# EAGLE design 4in4out (EAGLE 5.00)
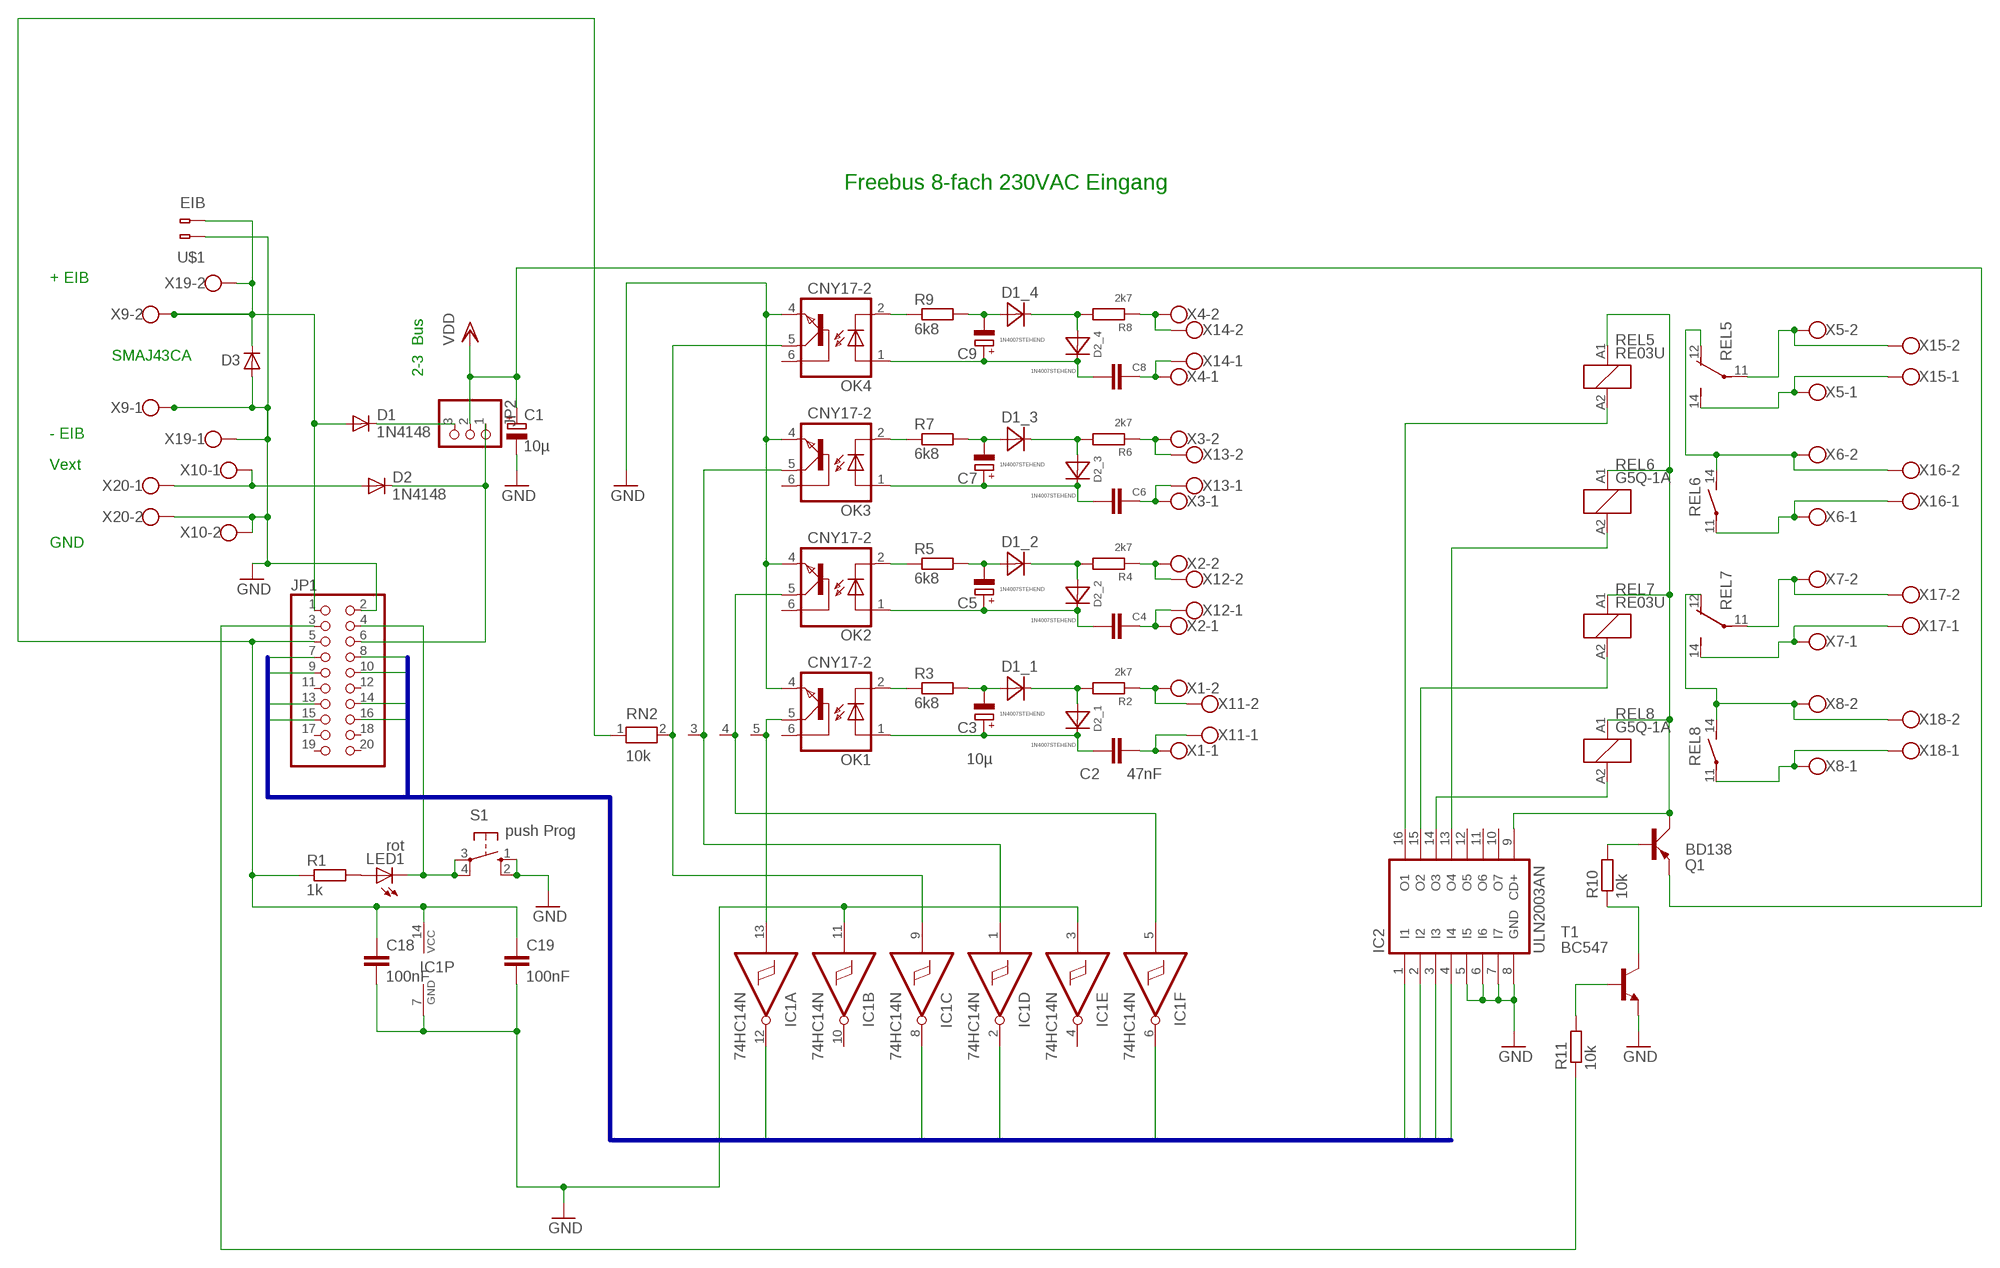
[diagram p0: schematic, sheet 1]

## Parts
C1  10µ  CPOL-EUE3.5-8  [E3,5-8]
C2  47nF  C-EU075-063X106  [C075-063X106]
C3  10µ  CPOL-EUE2-4  [E2-4]
C4  47nF  C-EU075-063X106  [C075-063X106]
C5  CPOL-EUE2-4  [E2-4]
C6  47nF  C-EU075-063X106  [C075-063X106]
C7  CPOL-EUE2-4  [E2-4]
C8  47nF  C-EU075-063X106  [C075-063X106]
C9  CPOL-EUE2-4  [E2-4]
C18  100nF  C-EU050-024X044  [C050-024X044]
C19  100nF  C-EU050-024X044  [C050-024X044]
D1  1N4148  [DO35-10]
D1_1  1N4007STEHEND  [RAD2,5]
D1_2  1N4007STEHEND  [RAD2,5]
D1_3  1N4007STEHEND  [RAD2,5]
D1_4  1N4007STEHEND  [RAD2,5]
D2  1N4148  [DO35-10]
D2_1  1N4007STEHEND  [RAD2,5]
D2_2  1N4007STEHEND  [RAD2,5]
D2_3  1N4007STEHEND  [RAD2,5]
D2_4  1N4007STEHEND  [RAD2,5]
D3  D-SMB  [SMB]
IC1  74HC14N  [DIL14]
IC2  ULN2003AN  [DIL16]
JP1  PINHD-2X10  [2X10]
JP2  PINHD-1X3  [1X03]
LED1  rot  LED3MM  [LED3MM]
OK1  CNY17-2  CNY17  [DIL06]
OK2  CNY17-2  CNY17  [DIL06]
OK3  CNY17-2  CNY17  [DIL06]
OK4  CNY17-2  CNY17  [DIL06]
Q1  BD138  BD140  [TO126AV]
R1  1k  R-EU_0204/7  [0204/7]
R2  2k7  R-EU_0207/2V  [0207/2V]
R3  6k8  R-EU_0207/2V  [0207/2V]
R4  2k7  R-EU_0207/2V  [0207/2V]
R5  6k8  R-EU_0207/2V  [0207/2V]
R6  2k7  R-EU_0207/2V  [0207/2V]
R7  6k8  R-EU_0207/2V  [0207/2V]
R8  2k7  R-EU_0207/2V  [0207/2V]
R9  6k8  R-EU_0207/2V  [0207/2V]
R10  10k  R-EU_0207/10  [0207/10]
R11  10k  R-EU_0207/10  [0207/10]
REL5  RE03U  [G5Q_1_EU]
REL6  G5Q-1A  RE030024  [RE-SCHRACK]
REL7  RE03U  [G5Q_1_EU]
REL8  G5Q-1A  RE030024  [RE-SCHRACK]
RN2  10k  RN04  [RN-5]
S1  push Prog  10-XX  [B3F-10XX]
T1  BC547  [TO92]
U$1  EIB  [BUSKLEMME243-724]
X1  W237-102W2POL5_08  [W237-132]
X2  W237-102W2POL5_08  [W237-132]
X3  W237-102W2POL5_08  [W237-132]
X4  W237-102W2POL5_08  [W237-132]
X5  W237-102W2POL5_08  [W237-132]
X6  W237-102W2POL5_08  [W237-132]
X7  W237-102W2POL5_08  [W237-132]
X8  W237-102W2POL5_08  [W237-132]
X9  W237-102W2POL5_08  [W237-132]
X10  W237-102W2POL5_08  [W237-132]
X11  W237-102AKL007-2P  [AKL007-02]
X12  W237-102AKL007-2P  [AKL007-02]
X13  W237-102AKL007-2P  [AKL007-02]
X14  W237-102AKL007-2P  [AKL007-02]
X15  W237-102AKL007-2P  [AKL007-02]
X16  W237-102AKL007-2P  [AKL007-02]
X17  W237-102AKL007-2P  [AKL007-02]
X18  W237-102AKL007-2P  [AKL007-02]
X19  W237-102AKL007-2P  [AKL007-02]
X20  W237-102AKL007-2P  [AKL007-02]

## Nets
230+_1: C2.1 C3.+ D2_1.C OK1.1(A)
230+_2: C4.1 C5.+ D2_2.C OK2.1(A)
230+_3: C6.1 C7.+ D2_3.C OK3.1(A)
230+_4: C8.1 C9.+ D2_4.C OK4.1(A)
230-_1: C3.- D1_1.A R3.2
230-_2: C5.- D1_2.A R5.2
230-_3: C7.- D1_3.A R7.2
230-_4: C9.- D1_4.A R9.2
230N_1: D1_1.C D2_1.A R2.2
230N_2: D1_2.C D2_2.A R4.2
230N_3: D1_3.C D2_3.A R6.2
230N_4: D1_4.C D2_4.A R8.2
GND: C1.- C18.2 C19.2 D3.2(A) IC1.3(E:I) IC1.7(P:GND) IC1.11(B:I) IC2.5(I5) IC2.6(I6) IC2.7(I7) IC2.8(GND) JP1.2 OK1.4(EMI) OK2.4(EMI) OK3.4(EMI) OK4.4(EMI) S1.1(S) S1.2(S1) T1.1(E) U$1.1(B-1) X9.1 X10.2 X19.1 X20.2
IO1: IC1.12(A:O) JP1.7
IO2: IC1.6(F:O) JP1.8
IO3: IC1.2(D:O) JP1.9
IO4: IC1.8(C:O) JP1.10
IO5: IC2.1(I1) JP1.13
IO6: IC2.4(I4) JP1.14
IO7: IC2.2(I2) JP1.15
IO8: IC2.3(I3) JP1.16
N$1: C8.2 X4.1 X14.1
N$2: R8.1 X4.2 X14.2
N$3: C6.2 X3.1 X13.1
N$4: R6.1 X3.2 X13.2
N$5: C4.2 X2.1 X12.1
N$6: R4.1 X2.2 X12.2
N$7: C2.2 X1.1 X11.1
N$8: R2.1 X1.2 X11.2
N$9: REL5.12(14:O) REL6.14(2:S) X6.2 X16.2
N$10: REL6.11(2:P) X6.1 X16.1
N$11: REL7.11(14:P) X7.2 X17.2
N$12: REL8.11(2:P) X8.1 X18.1
N$13: REL5.11(14:P) X5.2 X15.2
N$14: REL5.14(14:S) X5.1 X15.1
N$15: REL7.14(14:S) X7.1 X17.1
N$16: REL7.12(14:O) REL8.14(2:S) X8.2 X18.2
N$17: IC2.16(O1) REL5.A2
N$18: IC2.13(O4) REL6.A2
N$19: D2.A X10.1 X20.1
N$20: D1.A D3.1(C) JP1.1 U$1.2(B-2) X9.2 X19.2
N$21: IC2.15(O2) REL7.A2
N$22: IC2.14(O3) REL8.A2
N$23: IC1.13(A:I) OK1.5(COL) RN2.5
N$24: IC2.9(CD+) Q1.C REL5.A1 REL6.A1 REL7.A1 REL8.A1
N$25: IC1.5(F:I) OK2.5(COL) RN2.4
N$26: JP1.3 R11.1
N$27: JP1.4 LED1.K(C) S1.3(P) S1.4(P1)
N$28: LED1.A R1.2
N$29: IC1.1(D:I) OK3.5(COL) RN2.3
N$30: IC1.9(C:I) OK4.5(COL) RN2.2
N$32: D1.C JP2.3
N$33: R10.1 T1.3(C)
N$34: R11.2 T1.2(B)
N$35: D2.C JP1.6 JP2.1
N$37: Q1.B R10.2
OPT_1: OK1.2(C) R3.1
OPT_2: OK2.2(C) R5.1
OPT_3: OK3.2(C) R7.1
OPT_4: OK4.2(C) R9.1
VCC: C18.1 C19.1 IC1.14(P:VCC) JP1.5 R1.1 RN2.1
VDD: C1.+ JP2.2 Q1.E
Unconnected: IC1.4(E:O) IC1.10(B:O) IC2.10(O7) IC2.11(O6) IC2.12(O5) JP1.11 JP1.12 JP1.17 JP1.18 JP1.19 JP1.20 OK1.6(BAS) OK2.6(BAS) OK3.6(BAS) OK4.6(BAS)

## Buses
IO[1..8]

## Notes on the sheet
- Freebus 8-fach 230VAC Eingang
- + EIB
- SMAJ43CA
- 2-3  Bus
- - EIB
- Vext
- GND

## Library data of the parts
C1 C3 C5 C7 C9 = rcl:CPOL-EU: POLARIZED CAPACITOR, European symbol
C2 C4 C6 C8 C18 C19 = rcl:C-EU: CAPACITOR, European symbol
D1 D2 = diode:1N4148: DIODE high speed (Philips)
D1_1-D1_4 D2_1-D2_4 = diode:1N4007
D3 = semicon-smd-ipc:D-: DIODE unfilled
IC1 = 74xx-eu:74*14: Hex schmitt trigger INVERTER
IC2 = uln-udn:ULN2003A: DRIVER ARRAY
JP1 = pinhead:PINHD-2X10: PIN HEADER
JP2 = pinhead:PINHD-1X3: PIN HEADER
LED1 = led:LED: LED OSRAM: - CHIPLED LG R971, LG N971, LY N971, LG Q971, LY Q971, LO R971, LY R971 LH N974, LH R974 LS Q976, LO Q976, LY Q976 LO Q996 - Hyper CHIPLED LW Q18S LB Q993, LB Q99A, LB R99A - SideLED LS A670, LO A670, LY A670, LG A670, LP A670 LB A673, LV A673, LT A673, LW A673 LH A674 LY A675 LS A676, LA A676, LO A676, LY A676, LW A676 LS A679, LY A679, LG A679 - Hyper Micro SIDELED® LS Y876, LA Y876, LO Y876, LY Y876 LT Y87S - SmartLED LW L88C, LW L88S LB L89C, LB L89S, LG L890 LS L89K, LO L89K, LY L89K LS L896, LA L896, LO L896, LY L896 - TOPLED LS T670, LO T670, LY T670, LG T670, LP T670 LSG T670, LSP T670, LSY T670, LOP T670, LYG T670 LG T671, LOG T671, LSG T671 LB T673, LV T673, LT T673, LW T673 LH T674 LS T676, LA T676, LO T676, LY T676, LB T676, LH T676, LSB T676, LW T676 LB T67C, LV T67C, LT T67C, LS T67K, LO T67K, LY T67K, LW E67C LS E67B, LA E67B, LO E67B, LY E67B, LB E67C, LV E67C, LT E67C LW T67C LS T679, LY T679, LG T679 LS T770, LO T770, LY T770, LG T770, LP T770 LB T773, LV T773, LT T773, LW T773 LH T774 LS E675, LA E675, LY E675, LS T675 LS T776, LA T776, LO T776, LY T776, LB T776 LHGB T686 LT T68C, LB T68C - Hyper Mini TOPLED® LB M676 - Mini TOPLED Santana® LG M470 LS M47K, LO M47K, LY M47K Source: http://www.osram.convergy.de - LUMILED® LXK2-PW12-R00, LXK2-PW12-S00, LXK2-PW14-U00, LXK2-PW14-V00 LXK2-PM12-R00, LXK2-PM12-S00, LXK2-PM14-U00 LXK2-PE12-Q00, LXK2-PE12-R00, LXK2-PE12-S00, LXK2-PE14-T00, LXK2-PE14-U00 LXK2-PB12-K00, LXK2-PB12-L00, LXK2-PB12-M00, LXK2-PB14-N00, LXK2-PB14-P00, LXK2-PB14-Q00 LXK2-PR12-L00, LXK2-PR12-M00, LXK2-PR14-Q00, LXK2-PR14-R00 LXK2-PD12-Q00, LXK2-PD12-R00, LXK2-PD12-S00 LXK2-PH12-R00, LXK2-PH12-S00 LXK2-PL12-P00, LXK2-PL12-Q00, LXK2-PL12-R00 Source: www.luxeon.com
OK1-OK4 = optocoupler:CNY17: SIEMENS OPTO COUPLER
Q1 = transistor-power:BD140: PNP TRANSISTOR
R1-R11 = rcl:R-EU_: RESISTOR, European symbol
REL5 REL7 = freebus_relay:RE03U
REL6 REL8 = relay:RE03*: Miniature PCB Relay 1 pole 6 A SCHRACK Source: http://www.schrack.com/.. 5812.pdf
RN2 = resistor-net:RN04: RESISTOR NETWORK
S1 = switch-omron:10-XX: OMRON SWITCH
T1 = transistor:BC547: NPN TRANSISTOR
U$1 = con-wago:EIB
X1-X20 = con-wago-500:W237-102: WAGO SCREW CLAMP

## Board
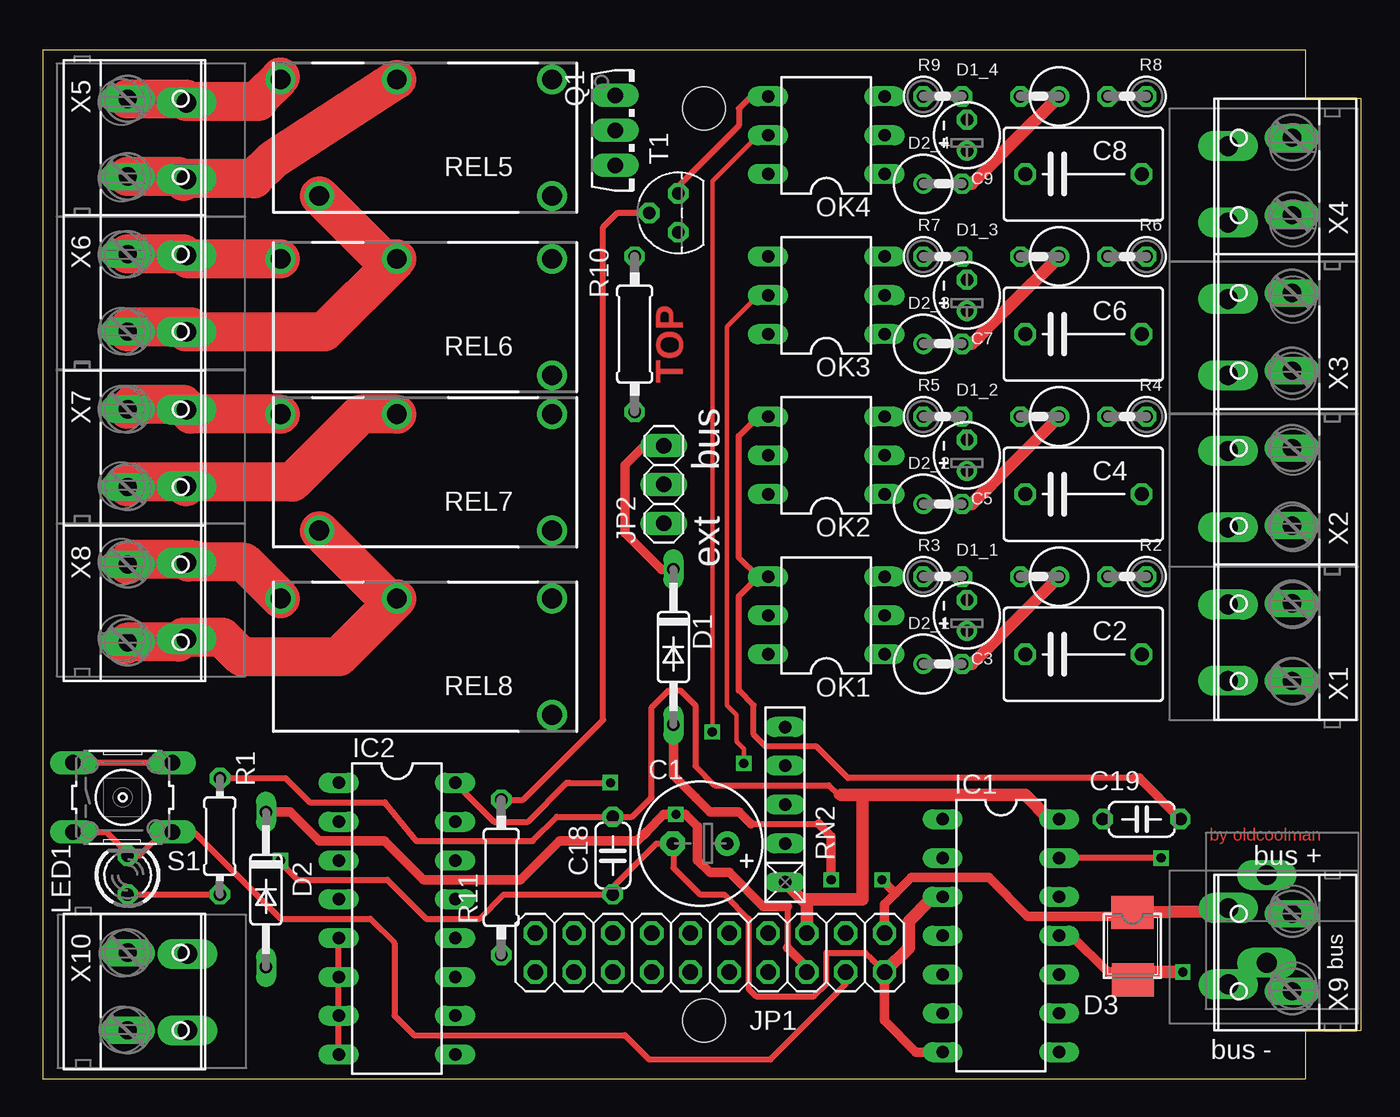
[diagram p1: board, top side]
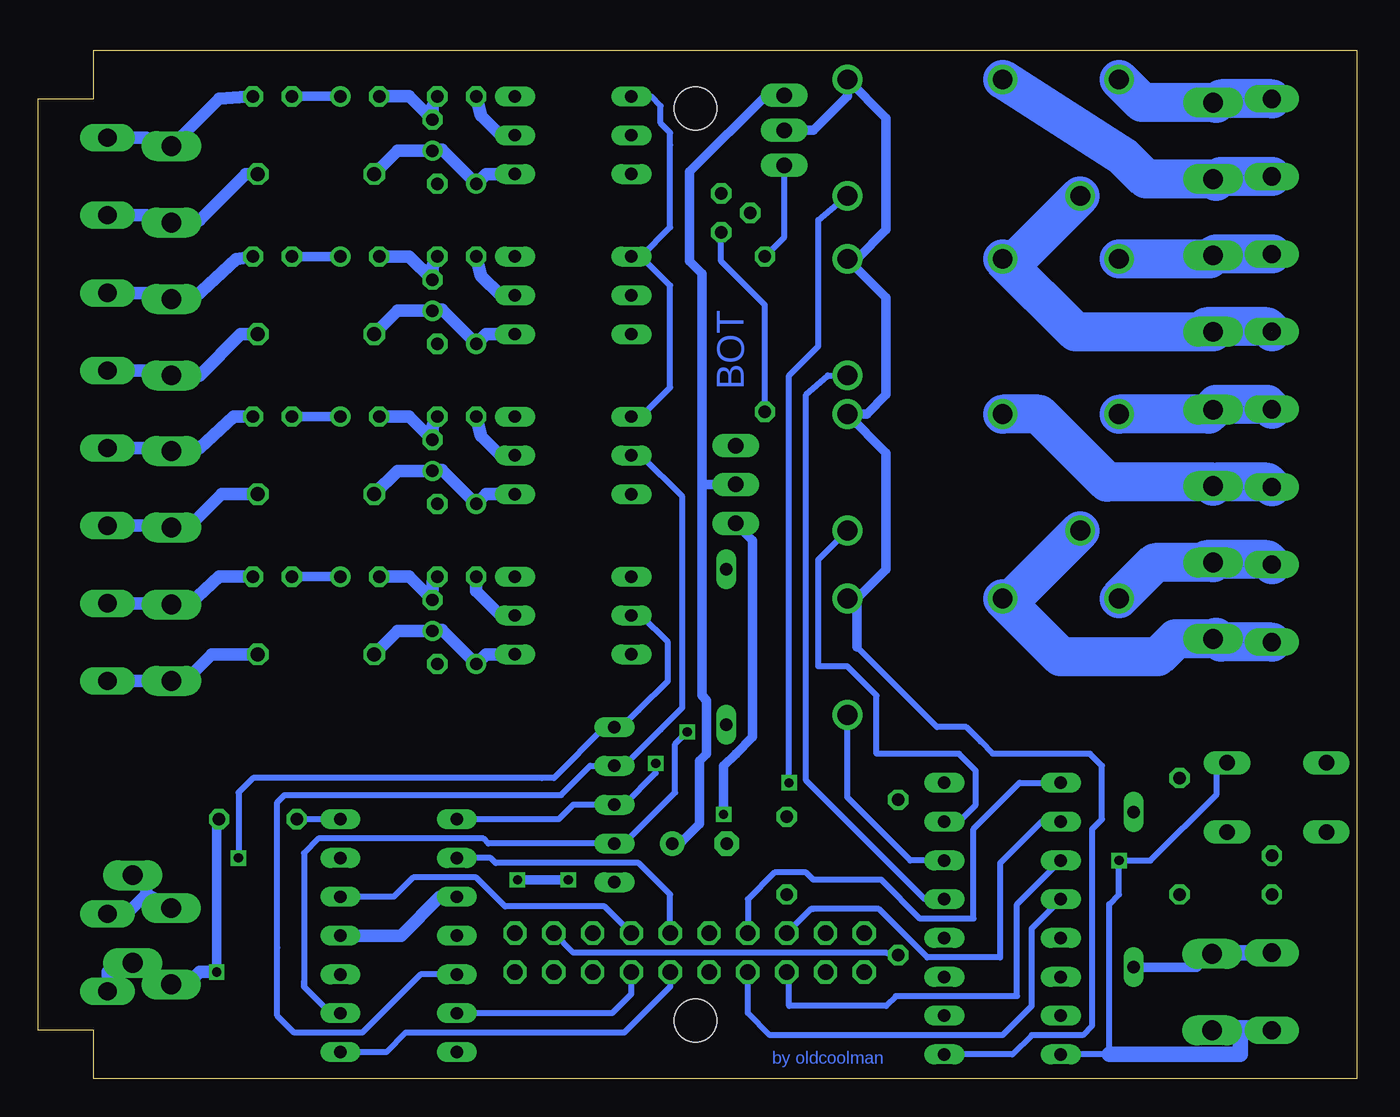
[diagram p2: board, bottom side, seen from below]

Size 86.28 x 67.31 mm. Coordinates in mm from the lower left corner, seen from the top.
Outline: 0,0.01 82.64,0 82.64,3.18 86.28,3.18 86.28,64.13 82.64,64.13 82.64,67.31 0,67.31 0,0.01
Copper layers (1*16): Top 0.035mm / dielectric 1.5mm / Bottom 0.035mm
Design rules "default": minimum track width 10mil, minimum drill 24mil, track to track 8mil, track to pad 8mil, pad to pad 8mil, via to via 8mil, smd to smd 8mil, copper to edge 40mil, drill to drill 8mil, minimum pad ring 10mil, minimum via ring 8mil, stop-mask expansion 4mil, vias tented up to drill 0mil, thermal gap 10mil
Holes 2.8 mm at 43.27,3.81 43.27,63.5

### Footprints (pad centres in the part's own frame; a part is rotated, then mirrored left to right if it is on the bottom)
E3,5-8 = drill 0.813 pad 1.6 round: + -1.778,0 | drill 0.813 pad 1.6 octagon: - 1.778,0
C075-063X106 = drill 0.914 octagon: 1 -3.81,0; 2 3.81,0
E2-4 = drill 0.813 pad 1.27 round: + -1.016,0 | drill 0.813 pad 1.27 octagon: - 1.016,0
C050-024X044 = drill 0.813 octagon: 1 -2.54,0; 2 2.54,0
DO35-10 = drill 0.813 long: A 5.08,0; C -5.08,0
RAD2,5 = drill 0.813 octagon: A 1.27,0 | drill 0.813 round: C -1.27,0
SMB = smd 2.159 x 2.743: 1 -2.311,-0.127; 2 2.108,-0.102
DIL14 = drill 0.813 long: 1 -7.62,-3.81; 2 -5.08,-3.81; 3 -2.54,-3.81; 4 0,-3.81; 5 2.54,-3.81; 6 5.08,-3.81; 7 7.62,-3.81; 8 7.62,3.81; 9 5.08,3.81; 10 2.54,3.81; 11 0,3.81; 12 -2.54,3.81; 13 -5.08,3.81; 14 -7.62,3.81
DIL16 = drill 0.813 long: 1 -8.89,-3.81; 2 -6.35,-3.81; 3 -3.81,-3.81; 4 -1.27,-3.81; 5 1.27,-3.81; 6 3.81,-3.81; 7 6.35,-3.81; 8 8.89,-3.81; 9 8.89,3.81; 10 6.35,3.81; 11 3.81,3.81; 12 1.27,3.81; 13 -1.27,3.81; 14 -3.81,3.81; 15 -6.35,3.81; 16 -8.89,3.81
2X10 = drill 1.016 octagon: 1 -11.43,-1.27; 2 -11.43,1.27; 3 -8.89,-1.27; 4 -8.89,1.27; 5 -6.35,-1.27; 6 -6.35,1.27; 7 -3.81,-1.27; 8 -3.81,1.27; 9 -1.27,-1.27; 10 -1.27,1.27; 11 1.27,-1.27; 12 1.27,1.27; 13 3.81,-1.27; 14 3.81,1.27; 15 6.35,-1.27; 16 6.35,1.27; 17 8.89,-1.27; 18 8.89,1.27; 19 11.43,-1.27; 20 11.43,1.27
1X03 = drill 1.016 long: 1 -2.54,0; 2 0,0; 3 2.54,0
LED3MM = drill 0.813 octagon: A -1.27,0; K 1.27,0
DIL06 = drill 0.813 long: 1 -2.54,-3.81; 2 0,-3.81; 3 2.54,-3.81; 4 2.54,3.81; 5 0,3.81; 6 -2.54,3.81
TO126AV = drill 1.016 long: B 2.286,-1.27; C 0,-1.27; E -2.286,-1.27
0204/7 = drill 0.813 octagon: 1 -3.81,0; 2 3.81,0
0207/2V = drill 0.813 octagon: 1 -1.27,0; 2 1.27,0
0207/10 = drill 0.813 octagon: 1 -5.08,0; 2 5.08,0
G5Q_1_EU = drill 1.3 round: 11 1.27,-3.81; 12 6.35,3.81; 14 8.89,-3.81; A1 -8.89,-3.81; A2 -8.89,3.81
RE-SCHRACK = drill 1.3 round: 11 8.89,-3.81; 14 1.27,-3.81; A1 -8.89,-3.81; A2 -8.89,3.81
RN-5 = drill 0.813 long: 1 -5.08,0; 2 -2.54,0; 3 0,0; 4 2.54,0; 5 5.08,0
B3F-10XX = drill 1.016 long: 1 -3.251,2.261; 2 3.251,2.261; 3 -3.251,-2.261; 4 3.251,-2.261
TO92 = drill 0.813 octagon: 1 1.27,0; 2 0,1.905; 3 -1.27,0
BUSKLEMME243-724 = drill 1.3 long: 1 -2.875,0; 2 2.875,0
W237-132 = drill 1.194 long: 1 -2.54,-0.635; 2 2.54,-0.635
AKL007-02 = drill 1.3 long: 1 -2.45,2.325; 2 2.55,2.325

### Placement (x,y rotation side)
C1  43.02,15.4 180 top
C2  68.1,27.78 0 top
C3  60.48,30.32 90 top
C4  68.1,38.26 0 top
C5  60.48,40.8 90 top
C6  68.1,48.74 0 top
C7  60.48,51.28 90 top
C8  68.1,59.21 0 top
C9  60.48,61.75 90 top
C18  37.3,14.61 270 top
C19  71.91,16.99 0 top
D1  41.27,28.26 270 top
D1_1  65.24,32.86 180 top
D1_2  65.24,43.34 180 top
D1_3  65.24,53.82 180 top
D1_4  65.24,64.29 180 top
D2  14.6,12.38 270 top
D2_1  58.89,27.15 0 top
D2_2  58.89,37.62 0 top
D2_3  58.89,48.1 0 top
D2_4  58.89,58.58 0 top
D3  71.43,8.57 270 top
IC1  62.7,9.37 270 top
IC2  23.17,10.48 270 top
JP1  43.65,8.25 180 top
JP2  40.63,38.89 90 top
LED1  5.55,13.33 90 top
OK1  51.27,30.32 90 top
OK2  51.27,40.8 90 top
OK3  51.27,51.28 90 top
OK4  51.27,61.75 90 top
Q1  38.73,62.07 270 top
R1  11.58,15.88 270 top
R2  70.96,32.86 180 top
R3  58.89,32.86 0 top
R4  70.96,43.34 180 top
R5  58.89,43.34 0 top
R6  70.96,53.82 180 top
R7  58.89,53.82 0 top
R8  70.96,64.29 180 top
R9  58.89,64.29 0 top
R10  38.73,48.74 90 top
R11  30,13.18 90 top
REL5  24.44,61.59 180 top
REL6  24.44,49.85 180 top
REL7  24.44,39.69 180 top
REL8  24.44,27.62 180 top
RN2  48.57,17.94 90 top
S1  5.23,18.42 0 top
T1  41.59,56.67 90 top
U$1  80.11,10.45 90 top
X1  81.12,28.57 90 top
X2  81.12,38.73 90 top
X3  81.12,48.89 90 top
X4  81.12,59.05 90 top
X5  6.18,61.59 270 top
X6  6.18,51.43 270 top
X7  6.18,41.27 270 top
X8  6.18,31.12 270 top
X9  81.12,8.25 90 top
X10  6.19,5.71 270 top
X11  79.89,28.49 90 top
X12  79.89,38.53 90 top
X13  79.89,48.49 90 top
X14  79.89,58.49 90 top
X15  7.07,61.43 270 top
X16  7.07,51.43 270 top
X17  7.07,41.34 270 top
X18  7.07,31.34 270 top
X19  79.9,8.62 90 top
X20  7.14,5.71 270 top

### Tracks (layer width: path | path; a pad name or v marks a point on that pad's centre or on a via)
230+_1
  Bottom 0.813: OK1.1 56.99,27.78 D2_1.C 59.84,29.37 60.48,29.37 C3.+ 62.76,29.31 C2.1
230+_2
  Bottom 0.813: OK2.1 56.99,38.26 D2_2.C 59.84,39.85 60.48,39.85 C5.+ 62.76,39.78 C4.1
230+_3
  Bottom 0.813: OK3.1 56.99,48.74 D2_3.C 59.84,50.32 60.48,50.32 C7.+ 62.76,50.26 C6.1
230+_4
  Bottom 0.813: OK4.1 56.99,59.21 D2_4.C 59.84,60.8 60.48,60.8 C9.+ 62.76,60.74 C8.1
230-_1
  Bottom 0.813: C3.- 60.48,31.27 | R3.2 60.48,32.54 C3.- | C3.- 62,32.86 D1_1.A
230-_2
  Bottom 0.813: C5.- 60.48,41.75 | R5.2 60.48,42.7 C5.- | C5.- 62,43.34 D1_2.A
230-_3
  Bottom 0.813: C7.- 60.48,52.23 | R7.2 60.48,53.18 C7.- | C7.- 62,53.82 D1_3.A
230-_4
  Bottom 0.813: C9.- 60.48,62.71 | R9.2 60.48,63.66 C9.- | C9.- 62,64.29 D1_4.A
230N_1
  Top 0.813: 60.8,27.15 | D2_1.A 60.8,27.15 | 60.8,27.15 61.91,28.26 D1_1.C
  Bottom 0.61: D1_1.C R2.2
230N_2
  Top 0.813: D2_2.A 60.8,37.62 61.27,38.1 62.07,38.89 D1_2.C
  Bottom 0.61: D1_2.C R4.2
230N_3
  Top 0.813: D2_3.A 60.8,48.1 61.11,48.42 61.59,48.89 63.02,50.32 D1_3.C
  Bottom 0.61: D1_3.C R6.2
230N_4
  Top 0.813: D2_4.A 60.8,58.58 61.75,59.53 63.34,61.12 D1_4.C
  Bottom 0.61: D1_4.C R8.2
GND  (via drill 0.6)
  Top 0.406: 46.83,32.86 45.56,34.13 45.56,42.07 46.83,43.34 OK2.4 | 46.83,32.86 OK1.4 | 46.83,32.86 47.62,32.86 | 46.83,32.86 45.56,31.59 45.56,25.4 46.51,24.45 46.51,22.54 47.3,21.75 50.64,21.75 52.06,20.32 52.7,19.69 71.43,19.69 | 41.27,13.81 43.02,12.07 44.6,12.07 46.19,10.48 46.19,5.87 46.67,5.4 50.48,5.4 51.27,6.19 51.27,8.25 53.81,8.25 54.29,7.78 | 54.29,7.78 | 54.29,7.78 JP1.2 | S1.2 7.89,20.68 | 7.89,20.68 S1.1 | 7.89,20.68 7.93,20.64 | C1.- 40.16,15.4 37.14,12.38 37.3,12.22 C18.2 30.95,12.07 30.16,12.07 28.57,10.48 25.08,10.48 22.54,13.02 16.66,13.02 15.55,14.13 v15.55,14.29 | C1.- 41.27,15.4 41.27,13.81 | C1.- | 41.27,13.81 | IC2.8 IC2.7 IC2.6 IC2.5 | T1.1 41.59,58.42 45.56,62.39 45.56,63.5 46.51,64.45 47.3,64.45 OK4.4 | OK4.4
  Top 0.61: JP1.2 55.08,3.81 57.14,1.75 IC1.7 | IC1.3 | 58.73,11.75 IC1.3 | IC1.11 67.3,9.37 69.69,6.99 71.43,6.99 71.44,6.99 D3.2 | C19.2 | 71.43,19.69 71.75,19.69 C19.2 | v74.61,6.99
  Top 0.813: D3.2 72.38,6.99 72.69,6.99 73.34,6.99 v74.61,6.99 | JP1.2 56.67,8.57 56.67,10.32 58.1,11.75 58.73,11.75
  Bottom 0.254: 81.75,6.99 U$1.1 79.21,6.99
  Bottom 0.305: 46.67,64.29 46.83,64.29
  Bottom 0.406: 46.83,64.29 OK4.4 | 46.83,53.82 44.92,55.72 44.92,61.12 44.92,61.91 45.56,62.55 45.56,63.66 46.19,64.29 46.67,64.29 | OK2.4 46.83,43.34 44.92,45.24 44.92,51.91 46.83,53.82 | 46.83,53.82 OK3.4 | S1.2 9.16,20.68 9.16,18.61 13.49,14.29 v15.55,14.29 15.55,12.07 16.19,11.43 16.19,1.59 IC2.8
  Bottom 0.61: v74.61,6.99 | C19.2 74.61,16.83 v74.61,6.99
  Bottom 0.813: 81.75,6.99 X9.1 | 79.21,6.99 X19.1 76.49,6.17 75.72,6.99 v74.61,6.99 | IC1.3 60,11.91 62.54,9.37 IC1.11
  Bottom 1.016: X10.2 5.39,3.17 5.39,3.33 7.61,3.33 | X20.2 9.52,3.16 9.52,3.33 7.61,3.33 | 16.19,1.59 7.61,1.59 7.61,3.33
IO1
  Bottom 0.406: 47.3,9.52 JP1.7 49.21,11.27 55.72,11.27 57.62,13.18 61.75,13.18 63.02,11.91 IC1.12
IO2
  Bottom 0.406: JP1.8 47.46,5.56 48.73,4.29 IC1.6
IO3
  Bottom 0.406: JP1.9 44.92,12.07 46.98,14.13 56.35,14.13 56.67,14.45 IC1.2
IO4
  Bottom 0.406: JP1.10 44.92,6.03 47.94,3.02 62.22,3.02 63.49,1.75 IC1.8
IO5
  Bottom 0.406: JP1.13 | JP1.13 39.84,11.75 38.09,13.49 36.03,13.49 35.55,13.02 31.11,13.02 28.57,10.48 25.08,10.48 25.08,16.35 22.06,19.37 IC2.1
IO6
  Bottom 0.406: JP1.14 39.84,4.29 38.41,2.86 23.17,2.86 21.27,4.76 21.27,9.84 IC2.4
IO7
  Bottom 0.406: JP1.15 35.71,11.11 35.55,11.11 | 35.55,11.11 | 35.55,11.11 31.27,11.11 28.09,7.94 23.33,7.94 23.33,14.13 20.63,16.83 IC2.2
IO8
  Bottom 0.406: JP1.16 37.14,6.83 37.14,4.76 30.79,4.76 30.16,5.4 22.22,5.4 22.22,11.43 IC2.3
N$1
  Bottom 0.254: X14.1 79.21,56.52
  Bottom 0.406: X14.1 77.47,56.04 77.31,56.2 75.72,56.2
  Bottom 0.813: 79.21,56.52 X4.1 | C8.2 72.7,59.21 75.72,56.2
N$2
  Bottom 0.254: X14.2 79.21,61.6
  Bottom 0.406: 77.62,60.96 77.56,61.02 X14.2
  Bottom 0.813: 79.21,61.6 X4.2 | R8.1 74.45,64.14 77.56,61.02
N$3
  Bottom 0.254: X13.1 79.21,46.35
  Bottom 0.406: 77.62,46.04 X13.1 75.72,46.04
  Bottom 0.813: 79.21,46.35 X3.1 | C6.2 73.02,48.74 75.72,46.04
N$4
  Bottom 0.254: X13.2 79.21,51.43
  Bottom 0.406: X13.2 77.56,51.06 77.62,51.12 76.04,51.12
  Bottom 0.813: 79.21,51.43 X3.2 | R6.1 73.34,53.66 76.04,51.12
N$5
  Bottom 0.254: X12.1 79.21,36.2
  Bottom 0.406: X12.1 77.56,36.14 77.62,36.2 77.31,36.51 76.04,36.51
  Bottom 0.813: 79.21,36.2 X2.1 | C4.2 74.29,38.26 76.04,36.51
N$6
  Bottom 0.254: X12.2 79.21,41.28
  Bottom 0.406: X12.2 77.56,41.22 77.62,41.28 75.72,41.28
  Bottom 0.813: 79.21,41.28 X2.2 | R4.1 73.5,43.34 75.72,41.28
N$7
  Bottom 0.254: X11.1 79.21,26.03
  Bottom 0.406: X11.1 77.62,26.04 77.62,26.03 76.67,26.03
  Bottom 0.813: 79.21,26.03 X1.1 | C2.2 74.92,27.78 76.67,26.03
N$8
  Bottom 0.254: X11.2 79.21,31.12
  Bottom 0.406: X11.2 77.56,31.05 77.62,31.12 76.35,31.12
  Bottom 0.813: 79.21,31.12 X1.2 | R2.1 74.45,32.86 76.35,31.12
N$9  (1 unrouted)
  Top 2.54: X6.2 5.71,49.21 9.68,49.21 9.36,48.89 18.41,48.89 REL6.14 22.22,53.66 REL5.12
  Bottom 2.54: X16.2 18.4,48.89 REL6.14 22.22,53.66 REL5.12 | X6.2 5.87,49.21 9.84,49.21
N$10
  Top 2.54: X6.1 9.2,53.97 9.52,53.66 REL6.11
  Bottom 2.54: X6.1 9.2,53.97 X16.1 9.62,53.66 REL6.11
N$11
  Top 2.54: X7.2 5.71,38.89 5.55,39.05 9.36,39.05 | 9.36,39.05 9.52,39.05 9.36,38.74 9.36,39.05 | 9.36,39.05 16.35,39.05 20.79,43.5 REL7.11
  Bottom 2.54: X7.2 5.87,39.05 9.2,39.05 9.2,38.98 X17.2 9.35,39.05 16.35,39.05 16.98,39.69 17.14,39.85 20.79,43.5 REL7.11
N$12
  Top 2.54: X8.1 5.71,33.97 9.84,33.97 9.52,33.81 13.17,33.81 REL8.11
  Bottom 2.54: 9.58,33.97 9.84,33.97 | 9.58,33.97 X18.1 13.2,33.78 REL8.11 | X8.1 5.87,33.97 9.58,33.97
N$13
  Top 2.54: X5.2 8.88,59.06 9.2,58.74 9.36,58.9 13.81,58.9 15.08,60.17 REL5.11
  Bottom 2.54: X5.2 8.88,59.06 9.2,58.74 9.35,58.89 X15.2 13.79,58.89 15.23,60.32 REL5.11
N$14
  Bottom 2.54: X5.1 8.88,64.14 9.2,63.82 9.27,63.89 X15.1 14.03,63.89 REL5.14
N$15
  Top 2.54: X7.1 5.71,43.97 5.87,44.13 9.2,44.13 9.68,43.5 REL7.14
  Bottom 2.54: X7.1 5.87,44.13 9.2,44.13 9.2,43.98 X17.1 9.68,43.5 REL7.14
N$16
  Top 2.54: 5.39,28.42 X8.2 8.88,28.57 9.2,28.89 11.74,28.89 13.01,27.62 19.36,27.62 22.85,31.12 | REL8.14 22.85,31.12 | 22.85,31.12 REL7.12
  Bottom 2.54: X8.2 8.88,28.57 9.2,28.89 9.31,28.78 X18.2 11.85,28.78 13.01,27.62 19.36,27.62 REL8.14 22.54,31.43 REL7.12
N$17  (via drill 0.6)
  Top 0.406: IC2.16 29.52,16.83 31.74,16.83 34.28,19.37 34.44,19.37 v37.14,19.37
  Bottom 0.406: v37.14,19.37 37.14,46.04 35.24,47.94 35.24,56.2 REL5.A2
N$18
  Bottom 0.406: REL6.A2 34.6,46.04 36.03,44.77 36.03,19.53 28.25,11.75 IC2.13
N$19
  Bottom 0.61: D2.A | 9.52,8.25 10.47,7.3 D2.A
  Bottom 1.016: 9.52,8.25 9.52,8.16 X20.1 | X10.1 9.52,8.25 | 9.52,8.25
N$20  (via drill 0.6)
  Top 0.406: 46.35,16.67 50.79,16.67
  Top 0.61: 55.79,12.14 55.08,11.43 JP1.1 | 55.79,12.14 56.83,13.18 61.91,13.18 64.45,10.64 70.8,10.64 71.27,10.64 | 71.27,10.64 | 71.27,10.64 D3.1 | D1.A 41.27,19.84 42.7,18.42 43.65,17.46 45.56,17.46 46.35,16.67 | 50.79,16.67 51.59,15.87 v51.59,13.02 | v54.92,13.02 55.79,12.14
  Top 0.813: D3.1 76.19,10.95 76.51,10.95 76.73,11.17 X19.2
  Bottom 0.254: 80.48,10.8 X9.2 | 79.21,13.33 U$1.2
  Bottom 0.406: v51.59,13.02
  Bottom 0.61: v51.59,13.02 v54.92,13.02
  Bottom 0.813: 79.21,12.07 80.48,10.8 | 79.21,12.07 79.21,13.33 | X19.2 79.21,12.07
N$21
  Bottom 0.406: REL7.A2 35.24,33.97 35.24,26.99 33.33,26.99 31.43,25.08 31.43,21.27 27.3,21.27 26.03,21.27 24.92,20.16 24.92,17.94 26.03,16.83 IC2.15
N$22
  Bottom 0.406: IC2.14 29.2,14.29 33.33,18.42 REL8.A2
N$23  (via drill 0.6)
  Top 0.406: v73.18,14.45 IC1.13
  Bottom 0.406: OK1.5 46.83,30.32 45.08,28.58 45.08,26.03 46.98,24.13 47.94,23.18 48.89,23.02 | v73.18,14.45 73.18,18.73 72.23,19.68 53.33,19.68 53.33,19.69 52.54,19.69 49.21,23.02 48.89,23.02 | 48.89,23.02 RN2.5 | IC1.13
N$24
  Bottom 0.406: REL6.A1 32.7,53.66 | 32.7,28.26 27.46,23.02 25.55,23.02 24.6,22.07 23.81,21.27 17.46,21.27 16.66,20.48 16.66,16.99 17.3,16.35 17.3,3.49 17.93,2.86 21.27,2.86 22.54,1.59 IC2.9
  Bottom 0.61: 32.7,53.66 30.79,55.56 30.79,62.86 REL5.A1 33.33,64.29 35.55,62.07 Q1.C | REL6.A1 30.79,51.12 30.79,44.77 32.06,43.5 REL7.A1 30.79,40.96 30.79,33.34 32.7,31.43 | 32.7,31.43 REL8.A1 | 32.7,28.26 32.7,31.43 | Q1.C
N$25
  Bottom 0.406: OK2.5 46.83,40.8 44.13,38.1 44.13,24.29 45.56,22.86 47.94,20.48 48.89,20.48 | IC1.5 61.27,6.83 65.08,3.02 69.53,3.02 70.64,4.13 70.64,8.57 70.64,18.1 70.16,18.57 52.06,18.57 50.16,20.48 48.89,20.48 | 48.89,20.48 RN2.4
N$26
  Bottom 0.406: JP1.3 51.27,8.25 30.79,8.25 | 30.47,8.1 30.79,8.25 | 30.47,8.1 | R11.1 | 30.79,8.25 30.16,8.25 R11.1
N$27
  Top 0.406: JP1.4 52.54,6.19 47.62,1.27 39.68,1.27 38.09,2.86 24.28,2.86 23.01,4.13 23.01,8.89 21.43,10.48 15.55,10.48 9.84,16.19 7.93,16.19 | S1.3 4.16,16.15 5.55,14.76 LED1.K 6.34,14.6 7.93,16.19 | 7.93,16.19 8.53,16.15 S1.4
N$28
  Top 0.406: R1.2 10.95,12.06 LED1.A
N$29  (via drill 0.6)
  Top 0.305: OK3.5 46.83,51.28 46.19,50.64 44.76,49.21 44.76,24.45 45.4,23.81 45.4,22.07 45.87,21.59 v45.87,20.64
  Bottom 0.406: v45.87,20.64 45.87,20 47.94,17.94 RN2.3 51.27,17.94 52.22,16.99 IC1.1
N$30  (via drill 0.6)
  Top 0.305: OK4.5 46.83,61.75 43.81,58.74 v43.81,22.7
  Top 0.406: v43.81,22.7
  Bottom 0.406: 68.89,6.03 68.89,14.76 67.94,15.72 57.14,15.72 56.83,15.4 RN2.2 47.94,15.4 44.6,18.73 44.6,21.91 v43.81,22.7 | 68.89,6.03 68.89,6.35 | IC1.9 67.15,4.29 68.89,6.03
N$31
  Top 2.54: 5.55,64.14 9.36,64.14 9.36,63.98 14.12,63.98 14.12,64.14 15.55,65.56
N$32
  Top 0.406: D1.C
  Top 0.61: JP2.3 39.36,41.43 38.09,40.16 38.09,35.72 40.48,33.34 D1.C
N$33
  Bottom 0.406: R10.1 38.73,50.64 41.59,53.5 T1.3
N$34
  Top 0.406: R11.2 31.43,18.26 33.97,20.8 | 33.97,20.8 | 33.97,20.8 36.67,23.49 36.67,55.72 37.62,56.67 T1.2
N$35  (via drill 0.6)
  Top 0.406: 48.73,11.27 48.73,8.57 | 50,7.3 JP1.6 | 39.52,16.19
  Top 0.61: 48.73,11.27 47.14,11.27 44.92,13.49 | 44.92,13.49 | 44.92,13.49 44.92,13.46 | 48.73,8.57 50,7.3 | D2.C 16.19,17.46 18.09,15.56 22.38,15.56 24.92,13.02 31.27,13.02 33.81,15.56 38.89,15.56 39.52,16.19 40.63,17.3 v41.43,17.3 42.06,17.3 42.86,16.51 42.86,14.29 43.65,13.49 44.92,13.49
  Bottom 0.406: 40.63,21.27
  Bottom 0.61: JP2.1 39.52,35.24 39.52,22.38 40.63,21.27 41.43,20.48 v41.43,17.3
N$37
  Bottom 0.406: 37.46,59.85 Q1.B 37.46,55.09 R10.2
OPT_1
  Bottom 0.813: OK1.2 56.03,30.32 57.62,31.91 R3.1
OPT_2
  Bottom 0.813: OK2.2 56.03,40.8 57.3,42.07 R5.1
OPT_3
  Bottom 0.813: OK3.2 56.03,51.28 57.3,52.55 R7.1
OPT_4
  Bottom 0.813: OK4.2 56.03,61.75 57.3,63.02 R9.1
VCC
  Top 0.406: 51.43,19.21 52.06,18.57 | 33.65,17.14 C18.1 38.57,17.14 39.84,18.42 39.84,24.29 40.95,25.4 41.75,25.4 42.7,24.45 42.7,20.48 43.97,19.21 51.43,19.21 | 33.65,17.14 32.06,15.56 24.44,15.56 22.38,18.1 17.46,18.1 15.87,19.69 R1.1 | 33.65,17.14 | 51.43,19.21
  Top 0.61: 52.06,18.57 53.65,18.57 52.06,18.57 52.22,18.57 | IC1.14
  Top 0.813: 53.65,18.57 52.22,18.57 | 53.65,18.57 64.29,18.57 65.88,16.99 IC1.14 | JP1.5 50,11.43 49.68,11.75 | 49.68,11.75 RN2.1 | 49.68,11.75 53.65,11.75 53.65,18.57
  Bottom 0.406: C19.1 | IC1.14 C19.1
VDD
  Top 0.406: C1.+ 44.76,15.4
  Top 0.61: 44.76,15.4
  Bottom 0.406: C1.+ 44.76,15.43 44.76,15.56 44.13,15.56 | 42.86,38.89
  Bottom 0.61: 42.86,38.89 42.86,25.08 42.54,24.77 42.54,21.27 43.02,20.8 43.02,16.67 44.13,15.56 | 42.86,38.89 JP2.2 | 42.86,38.89 42.86,52.71 43.65,53.5 43.65,59.37 38.57,64.45 37.46,64.45 Q1.E

### Text on the board
Top: TOP | by oldcoolman
Bottom: BOT | by oldcoolman
tPlace: bus | ext | bus + | bus | bus -
tValues: fb_in_8_230V_03